# EAGLE design Adafruit 2.4in TFT FeatherWing V2 (EAGLE 9.6.2)
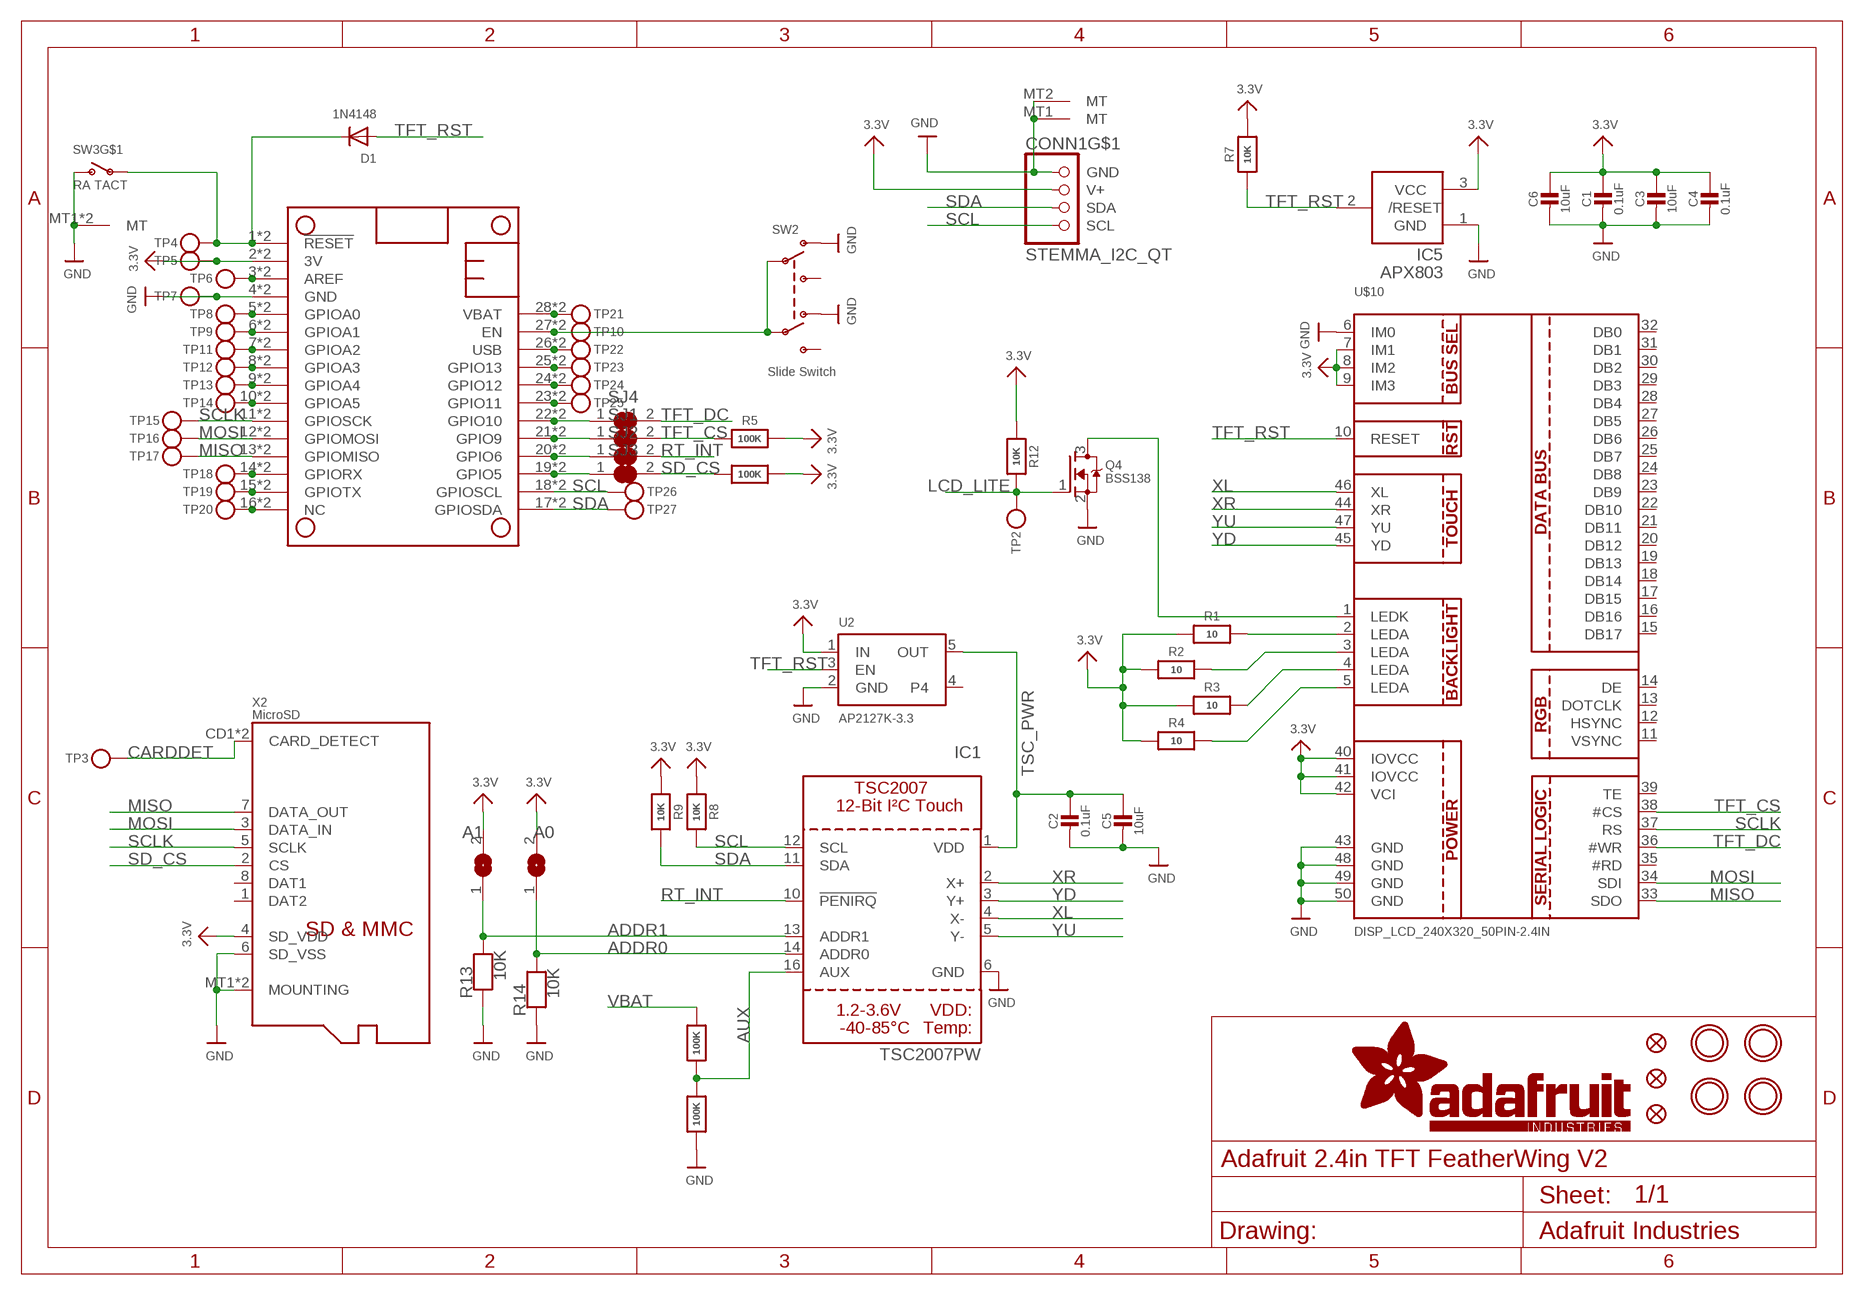
[diagram p0: schematic, sheet 1]

## Parts
C1  0.1uF  CAP_CERAMIC0603_NO  [0603-NO]
C2  0.1uF  CAP_CERAMIC0603_NO  [0603-NO]
C3  10uF  CAP_CERAMIC0805-NOOUTLINE  [0805-NO]
C4  0.1uF  CAP_CERAMIC0603_NO  [0603-NO]
C5  10uF  CAP_CERAMIC0805-NOOUTLINE  [0805-NO]
C6  10uF  CAP_CERAMIC0805-NOOUTLINE  [0805-NO]
CONN1  STEMMA_I2C_QT  [JST_SH4]
D1  1N4148  DIODESOD-323  [SOD-323]
FID1  FIDUCIAL_1MM  [FIDUCIAL_1MM]
FID2  FIDUCIAL_1MM  [FIDUCIAL_1MM]
FID3  FIDUCIAL_1MM  [FIDUCIAL_1MM]
IC1  TSC2007PW  [TSSOP16]
IC5  APX803  AXP083-SAG  [SOT23]
ICSP_CLK1  A1  SOLDERJUMPER  [SOLDERJUMPER_ARROW_NOPASTE]
ICSP_CLK2  A0  SOLDERJUMPER  [SOLDERJUMPER_ARROW_NOPASTE]
MS2  FEATHERWING_SMTDUAL  [FEATHERWING_SMT2]
Q4  BSS138  MOSFET-NWIDE  [SOT23-WIDE]
R1  10  RESISTOR_0603_NOOUT  [0603-NO]
R2  10  RESISTOR_0603_NOOUT  [0603-NO]
R3  10  RESISTOR_0603_NOOUT  [0603-NO]
R4  10  RESISTOR_0603_NOOUT  [0603-NO]
R5  100K  RESISTOR_0603_NOOUT  [0603-NO]
R6  100K  RESISTOR_0603_NOOUT  [0603-NO]
R7  10K  RESISTOR_0603_NOOUT  [0603-NO]
R8  10K  RESISTOR_0603_NOOUT  [0603-NO]
R9  10K  RESISTOR_0603_NOOUT  [0603-NO]
R10  100K  RESISTOR_0603_NOOUT  [0603-NO]
R11  100K  RESISTOR_0603_NOOUT  [0603-NO]
R12  10K  RESISTOR_0603_NOOUT  [0603-NO]
R13  10K  RESISTOR_0603_NOOUT  [0603-NO]
R14  10K  RESISTOR_0603_NOOUT  [0603-NO]
SJ1  SOLDERJUMPER_CLOSED  [SOLDERJUMPER_CLOSEDWIRE]
SJ2  SOLDERJUMPER_CLOSED  [SOLDERJUMPER_CLOSEDWIRE]
SJ3  SOLDERJUMPER_CLOSED  [SOLDERJUMPER_CLOSEDWIRE]
SJ4  SOLDERJUMPER_CLOSED  [SOLDERJUMPER_CLOSEDWIRE]
SW2  Slide Switch  SWITCH_DPDTEG1390  [EG1390]
SW3  RA TACT  SWITCH_SPST_MNT_TACT_RA  [SPST_TACTILE_RA]
TP2  TESTPOINTPAD2MM  [TESTPOINT_PAD_2MM]
TP3  TESTPOINTPAD2MM  [TESTPOINT_PAD_2MM]
TP4  TESTPOINTPAD2MM  [TESTPOINT_PAD_2MM]
TP5  TESTPOINTPAD2MM  [TESTPOINT_PAD_2MM]
TP6  TESTPOINTPAD2MM  [TESTPOINT_PAD_2MM]
TP7  TESTPOINTPAD2MM  [TESTPOINT_PAD_2MM]
TP8  TESTPOINTPAD2MM  [TESTPOINT_PAD_2MM]
TP9  TESTPOINTPAD2MM  [TESTPOINT_PAD_2MM]
TP10  TESTPOINTPAD2MM  [TESTPOINT_PAD_2MM]
TP11  TESTPOINTPAD2MM  [TESTPOINT_PAD_2MM]
TP12  TESTPOINTPAD2MM  [TESTPOINT_PAD_2MM]
TP13  TESTPOINTPAD2MM  [TESTPOINT_PAD_2MM]
TP14  TESTPOINTPAD2MM  [TESTPOINT_PAD_2MM]
TP15  TESTPOINTPAD2MM  [TESTPOINT_PAD_2MM]
TP16  TESTPOINTPAD2MM  [TESTPOINT_PAD_2MM]
TP17  TESTPOINTPAD2MM  [TESTPOINT_PAD_2MM]
TP18  TESTPOINTPAD2MM  [TESTPOINT_PAD_2MM]
TP19  TESTPOINTPAD2MM  [TESTPOINT_PAD_2MM]
TP20  TESTPOINTPAD2MM  [TESTPOINT_PAD_2MM]
TP21  TESTPOINTPAD2MM  [TESTPOINT_PAD_2MM]
TP22  TESTPOINTPAD2MM  [TESTPOINT_PAD_2MM]
TP23  TESTPOINTPAD2MM  [TESTPOINT_PAD_2MM]
TP24  TESTPOINTPAD2MM  [TESTPOINT_PAD_2MM]
TP25  TESTPOINTPAD2MM  [TESTPOINT_PAD_2MM]
TP26  TESTPOINTPAD2MM  [TESTPOINT_PAD_2MM]
TP27  TESTPOINTPAD2MM  [TESTPOINT_PAD_2MM]
U2  AP2127K-3.3  VREG_SOT23-5  [SOT23-5]
U$9  MOUNTINGHOLE2.5  [MOUNTINGHOLE_2.5_PLATED]
U$10  DISP_LCD_240X320_50PIN-2.4IN  [TFT_2.4IN_240X320_50PIN]
U$11  MOUNTINGHOLE2.5  [MOUNTINGHOLE_2.5_PLATED]
U$15  MOUNTINGHOLE2.5  [MOUNTINGHOLE_2.5_PLATED]
U$17  MOUNTINGHOLE2.5  [MOUNTINGHOLE_2.5_PLATED]
X2  MicroSD  MICROSD  [MICROSD]

## Nets
3.3V: C1.1 C3.1 C4.1 C6.1 CONN1.2(V+) IC5.3(VCC) ICSP_CLK1.2 ICSP_CLK2.2 MS2.2'(3V) MS2.2(3V) R1.1 R2.1 R3.1 R4.1 R5.2 R6.2 R7.2 R8.1 R9.1 R12.1 TP5.P$1 U2.1(IN) U$10.7(IM1) U$10.8(IM2) U$10.9(IM3) U$10.40(IOVCC) U$10.41(IOVCC) U$10.42(VCI) X2.4(SD_VDD)
!RESET: D1.C MS2.1'(!RESET) MS2.1(!RESET) SW3.1(P) TP4.P$1
A: MS2.5'(GPIOA0) MS2.5(GPIOA0) TP8.P$1
ADDR0: IC1.14(ADDR0) ICSP_CLK2.1 R14.2
ADDR1: IC1.13(ADDR1) ICSP_CLK1.1 R13.2
AREF: MS2.3'(AREF) MS2.3(AREF) TP6.P$1
AUX: IC1.16(AUX) R10.1 R11.2
B: MS2.6'(GPIOA1) MS2.6(GPIOA1) TP9.P$1
C: MS2.7'(GPIOA2) MS2.7(GPIOA2) TP11.P$1
CARDDET: TP3.P$1 X2.CD1(CARD_DETECT) X2.CD2(CARD_DETECT)
D: MS2.8'(GPIOA3) MS2.8(GPIOA3) TP12.P$1
E: MS2.9'(GPIOA4) MS2.9(GPIOA4) TP13.P$1
EN: MS2.27'(EN) MS2.27(EN) SW2.P1 SW2.P2 TP10.P$1
F: MS2.10'(GPIOA5) MS2.10(GPIOA5) TP14.P$1
G: MS2.16'(NC) MS2.16(NC) TP20.P$1
GND: C1.2 C2.2 C3.2 C4.2 C5.2 C6.2 CONN1.1(GND) CONN1.MT1(MT) CONN1.MT2(MT) IC1.6(GND) IC5.1(GND) MS2.4'(GND) MS2.4(GND) Q4.2(S) R11.1 R13.1 R14.1 SW2.O1 SW2.O2 SW3.2(S) SW3.MT1(MT) SW3.MT2(MT) TP7.P$1 U2.2(GND) U$10.6(IM0) U$10.43(GND) U$10.48(GND) U$10.49(GND) U$10.50(GND) X2.6(SD_VSS) X2.MT1(MOUNTING) X2.MT2(MOUNTING)
H: MS2.19'(GPIO5) MS2.19(GPIO5) SJ3.1
I: MS2.20'(GPIO6) MS2.20(GPIO6) SJ2.1
J: MS2.21'(GPIO9) MS2.21(GPIO9) SJ1.1
K: MS2.22'(GPIO10) MS2.22(GPIO10) SJ4.1
L: MS2.23'(GPIO11) MS2.23(GPIO11) TP25.P$1
LCD_LITE: Q4.1(G) R12.2 TP2.P$1
M: MS2.24'(GPIO12) MS2.24(GPIO12) TP24.P$1
MISO: MS2.13'(GPIOMISO) MS2.13(GPIOMISO) TP17.P$1 U$10.33(SDO) X2.7(DATA_OUT)
MOSI: MS2.12'(GPIOMOSI) MS2.12(GPIOMOSI) TP16.P$1 U$10.34(SDI) X2.3(DATA_IN)
N: MS2.25'(GPIO13) MS2.25(GPIO13) TP23.P$1
N$1: R4.2 U$10.5(LEDA)
N$2: R1.2 U$10.2(LEDA)
N$3: R2.2 U$10.3(LEDA)
N$4: R3.2 U$10.4(LEDA)
N$5: Q4.3(D) U$10.1(LEDK)
RT_INT: IC1.10(!PENIRQ) SJ2.2
RX: MS2.14'(GPIORX) MS2.14(GPIORX) TP18.P$1
SCL: CONN1.4(SCL) IC1.12(SCL) MS2.18'(GPIOSCL) MS2.18(GPIOSCL) R8.2 TP26.P$1
SCLK: MS2.11'(GPIOSCK) MS2.11(GPIOSCK) TP15.P$1 U$10.37(RS) X2.5(SCLK)
SD_CS: R6.1 SJ3.2 X2.2(CS)
SDA: CONN1.3(SDA) IC1.11(SDA) MS2.17'(GPIOSDA) MS2.17(GPIOSDA) R9.2 TP27.P$1
TFT_CS: R5.1 SJ1.2 U$10.38(#CS)
TFT_DC: SJ4.2 U$10.36(#WR)
TFT_RST: D1.A IC5.2(/RESET) R7.1 U2.3(EN) U$10.10(RESET)
TSC_PWR: C2.1 C5.1 IC1.1(VDD) U2.5(OUT)
TX: MS2.15'(GPIOTX) MS2.15(GPIOTX) TP19.P$1
USB: MS2.26'(USB) MS2.26(USB) TP22.P$1
VBAT: MS2.28'(VBAT) MS2.28(VBAT) R10.2 TP21.P$1
XL: IC1.4(X-) U$10.46(XL)
XR: IC1.2(X+) U$10.44(XR)
YD: IC1.3(Y+) U$10.45(YD)
YU: IC1.5(Y-) U$10.47(YU)
Unconnected: SW2.S1 SW2.S2 U2.4 U$10.11(VSYNC) U$10.12(HSYNC) U$10.13(DOTCLK) U$10.14(DE) U$10.15(DB17) U$10.16(DB16) U$10.17(DB15) U$10.18(DB14) U$10.19(DB13) U$10.20(DB12) U$10.21(DB11) U$10.22(DB10) U$10.23(DB9) U$10.24(DB8) U$10.25(DB7) U$10.26(DB6) U$10.27(DB5) U$10.28(DB4) U$10.29(DB3) U$10.30(DB2) U$10.31(DB1) U$10.32(DB0) U$10.35(#RD) U$10.39(TE) X2.1(DAT2) X2.8(DAT1)

## Library data of the parts
C1-C6 = microbuilder:CAP_CERAMIC: Ceramic Capacitors For new designs, use the packages preceded by an '_' character since they are more reliable: The following footprints should be used on most boards: _0402 - Standard footprint for regular board layouts _0603 - Standard footprint for regular board layouts _0805 - Standard footprint for regular board layouts _1206 - Standard footprint for regular board layouts For extremely tight-pitch boards where space is at a premium, the following 'micro-pitch' footprints can be used (smaller pads, no silkscreen outline, etc.): _0402MP - Micro-pitch footprint for very dense/compact boards _0603MP - Micro-pitch footprint for very dense/compact boards _0805MP - Micro-pitch footprint for very dense/compact boards _1206MP - Micro-pitch footprint for very dense/compact boards
CONN1 = adafruit_electromech:STEMMA_I2C; LCSC: C2845363
D1 = microbuilder:DIODE: Diode SMA Model Volts Amps Type Vf Ir Digikey # Notes SSA34-E3 40V 3A Schottky 480mV @ 3A 200uA @ 40V SSA34-E3/61TGITR-ND CDBA120-G 20V 1A Schottky 500mV @ 1A 500uA @ 20V 641-1014-6-ND REEL MBRA210 10V 2A Schottky 350mV @ 2A 700uA @ 10V MBRA210LT3 SOD-123 Model Volts Amps Type Vf Ir Order # Notes BAT54T1G 30V 200mA Schottky 800mV @ 200mA 2uA @ 25V BAT54T1GOSTR-ND B0530W 30V 500mA Schottky 430mV @ 500mA 130uA @ 30V B0530W-FDICT-ND REEL MBR120 20V 1A Schottky 340mV @ 1A MBR120VLSFT1GOSCT-ND SOD-323 Model Volts Amps Type Vf Ir Order # Notes PMEG2005EJ 20V 500mA Schottky 355mV @ 500mA 568-4110-1-ND ZLLS410 10V 570mA Schottky 380mV @ 570mA ZLLS410CT-ND 1N4148WS 75V 150mA Silicon/Simple 1V 1N4148WSFSCT-ND REEL SOD-523 Model Volts Amps Type Vf Ir Order # Notes BAT54XV2 30V 200mA Schottky 0.8V @ 100mA BAT54XV2CT-ND TB751S 30V 30mA Schottky RB751S-40TE61CT-ND SOT23-R/W (R = Solder Paste/Reflow Ovens, W = Hand-Soldering) Model Volts Amps Type Vf Ir Order # Notes BAT54FILM 40V 300mA Schottky 497-7162-1-ND POWERDI-5 Model Volts Amps Type Vf Ir Order # Notes PDS560 60V 5A Schottky 670mV @ 5A 150uA @ 60V PDS560DICT-ND
FID1-FID3 = microbuilder:FIDUCIAL: Fiducial Alignment Points Various fiducial points for machine vision alignment.; BOM: EXCLUDE
IC1 = adafruit_sensor:TSC2007
IC5 = adafruit:AXP083
ICSP_CLK1 ICSP_CLK2 = microbuilder:SOLDERJUMPER: SMD Solder JUMPER Solder the two pads together to create a connection, or remove the solder to break it. REFLOW - Use this footprint for solder paste and reflow ovens. WAVE - Use this footprint for hand-soldering (larger pads). CLOSED - Has a trace between the two pads to ensure it is closed by default. The trace needs to be cut to disable the jumper, and can be closed again by creating a solder bridge between the two pads.; BOM: EXCLUDE
MS2 = microbuilder:FEATHERWING
Q4 = microbuilder:MOSFET-N: N-Channel Mosfet LEGEND VDS: Voltage Drain-Source ID: Drain Current RDS(ON): Drain-Source On-State Resistance VGS(TH): Gate-Source Threshold Voltage CISS: Drain-Source Input Capacitance SOT-23 Name VDS ID RDS(ON) VGS(TH) CISS Order Number 2N7002E 60V 260mA 2.5 Ohm 2.5V @ 250uA 26.7pF @ 25V 2N7002ET1GOSTR-ND BSH103 30V 850mA 400 mOhm 400mV @ 1mA 83pF @ 24V BSH103,235-ND BSS138 60V 320mA 1.6 Ohm 1.5V @ 250uA 50pF @ 10V Mouser: 771-BSS138PW115 DMN2075U-7 20V 4.2A 38 mOhm 1V @ 250 uA 594.3pF @ 10V DMN2075U-7DICT-ND * BSS138 good choice for I2C level-shifting POWERPAK 1212-8 Name VDS ID RDS(ON) VGS(TH) CISS Order Number Si7308DN 60V 6A 58 mOhm 3V @ 250uA 665pF @ 15V SI7308DN-T1-E3CT-ND
R1-R14 = microbuilder:RESISTOR: Resistors For new designs, use the packages preceded by an '_' character since they are more reliable: The following footprints should be used on most boards: _0402 - Standard footprint for regular board layouts _0603 - Standard footprint for regular board layouts _0805 - Standard footprint for regular board layouts _1206 - Standard footprint for regular board layouts For extremely tight-pitch boards where space is at a premium, the following 'micro-pitch' footprints can be used (smaller pads, no silkscreen outline, etc.): _0402MP - Micro-pitch footprint for very dense/compact boards _0603MP - Micro-pitch footprint for very dense/compact boards _0805MP - Micro-pitch footprint for very dense/compact boards _1206MP - Micro-pitch footprint for very dense/compact boards
SJ1-SJ4 = microbuilder:SOLDERJUMPER_CLOSED: Solder Jumper - Closed These solder jumpers are closed by default CLOSEDWIRE - 10 mil trace between pads that can be cut and resoldered later CLOSEDPERM - 63 mil trace between pads for a permanent connection (used to 'bridge' two signals, a shameless hack for Eagle). Can double as a test point as well (no cream layer)
SW2 = adafruit_electromech:SWITCH_DPDT: Switch - DPDT A DPDT Switch acts like an SPDT switch, but has a pair of switches instead of just one. Vertical - 0.3A @ 6V SMT - Digikey: JS202011SCQN; LCSC: C2837066
SW3 = adafruit_electromech:SWITCH_SPST_MNT: Switch - SPST 4UCon 19192 (6.7x2.6mm SMT); LCSC: C778159
TP2-TP27 = microbuilder:TESTPOINT: Test Point Various test points for characterisation and PCB testing TESTPOINT_SMT - Compact Surface Mount Test Point [Digikey: 5016KTR-ND]
U2 = adafruit_power:VREG_SOT23-5: SOT23-5 Fixed Voltage Regulators Part Current Out V Out V In V Dropout θJA (°C/W) TJ (°C) Digikey Part No. ADP121 150mA 3.3V 3.4-5.5V 0.09V @ 150mA -- -- ADP121-AUJZ33R7CT-ND ADP121 150mA 3.0V 3.1-5.5V 0.09V @ 150mA -- -- ADP121-AUJZ30R7CT-ND ADP122 300mA 3.3V 3.4-5.5V 0.085V @ 300mA -- -- ADP122AUJZ-3.3-R7CT-ND ADP1712 300mA 3.3V 3.5-5.5V 0.17V @ 300mA -- -- ADP1712AUJZ-3.3-R7TR-ND AP7311 (Low Cost) 150mA 3.3V 3.5-6V 0.15V @ 150mA -- -- AP7311-33WG-7DICT-ND LD39015M18R 150mA 1.8V 1.9V-5.5V 0.08V @ 100mA -- -- 497-6977-1-ND LP2985A-33DBVR 150mA 3.3V 3.3-16V 0.28V @ 150mA 206 150 296-18479-1-ND MCP1824T-3302E/OT 300mA 3.3V 3.5V-6V 0.2V @ 300mA -- -- MCP1824T-3302E/OTCT-ND MIC5205-2.5YM5 TR 150mA 2.5V 2.7-16V 0.165V @ 150mA -- -- 576-1257-2-ND MIC5205-3.0YM5 TR 150mA 3.0V 3.2V-16V 0.165V @ 150mA -- -- 576-1258-2-ND MIC5205-3.3YM5 TR 150mA 3.3V 3.5V-16V 0.165V @ 150mA -- -- 576-1259-2-ND TPS780330220 150mA 3.3V+2.2V 3.6-5.5V 250mV Max -- -- 296-23332-1-ND TDA3663/N1,135 100mA 3.3V 3.5-45V 0.18V @ 50mA -- -- 568-5343-1-ND Max operating temp can be calculated using θJA, TJ (max junction temperature), and power in watts. Set the "Maximum Ambient Temperature" until it reaches TJ ("Max Junction Temperature"), which is the absolute limit for safe use of the regulator: Heat Sink Temperature Calculator <http://www.daycounter.com/Calculators/Heat-Sink-Temperature-Calculator.phtml> For example, With 12V source into a 3.3V LP2985 and a 30mA load, we are dissipating (12V-3.3V) * 0.03A = 0.261W. With a θJA of 206 °C/W, a TJ of 150°C, and 261mW we can safely use the chip without a heat sink up to 75°C (=147.1°C Junction Temperature).; JLC_ROTATION: 270
U$9 U$11 U$15 U$17 = adafruit_electromech:MOUNTINGHOLE: Mounting Hole For #2 screws (0.086"/2.18mm width, 0.094"/2.4mm hole) use 2.5mm; BOM: EXCLUDE
U$10 = adafruit_display:DISP_LCD_240X320_50PIN
X2 = adafruit_electromech:MICROSD: MicroSD/Transflash Card Holder with SPI pinout 3M: 2908-05WB-MG 4UConnector: 19656 Footprint courtesy: Adafruit Industries; JLC_ROTATION: 90; LCSC: C125617

## Board
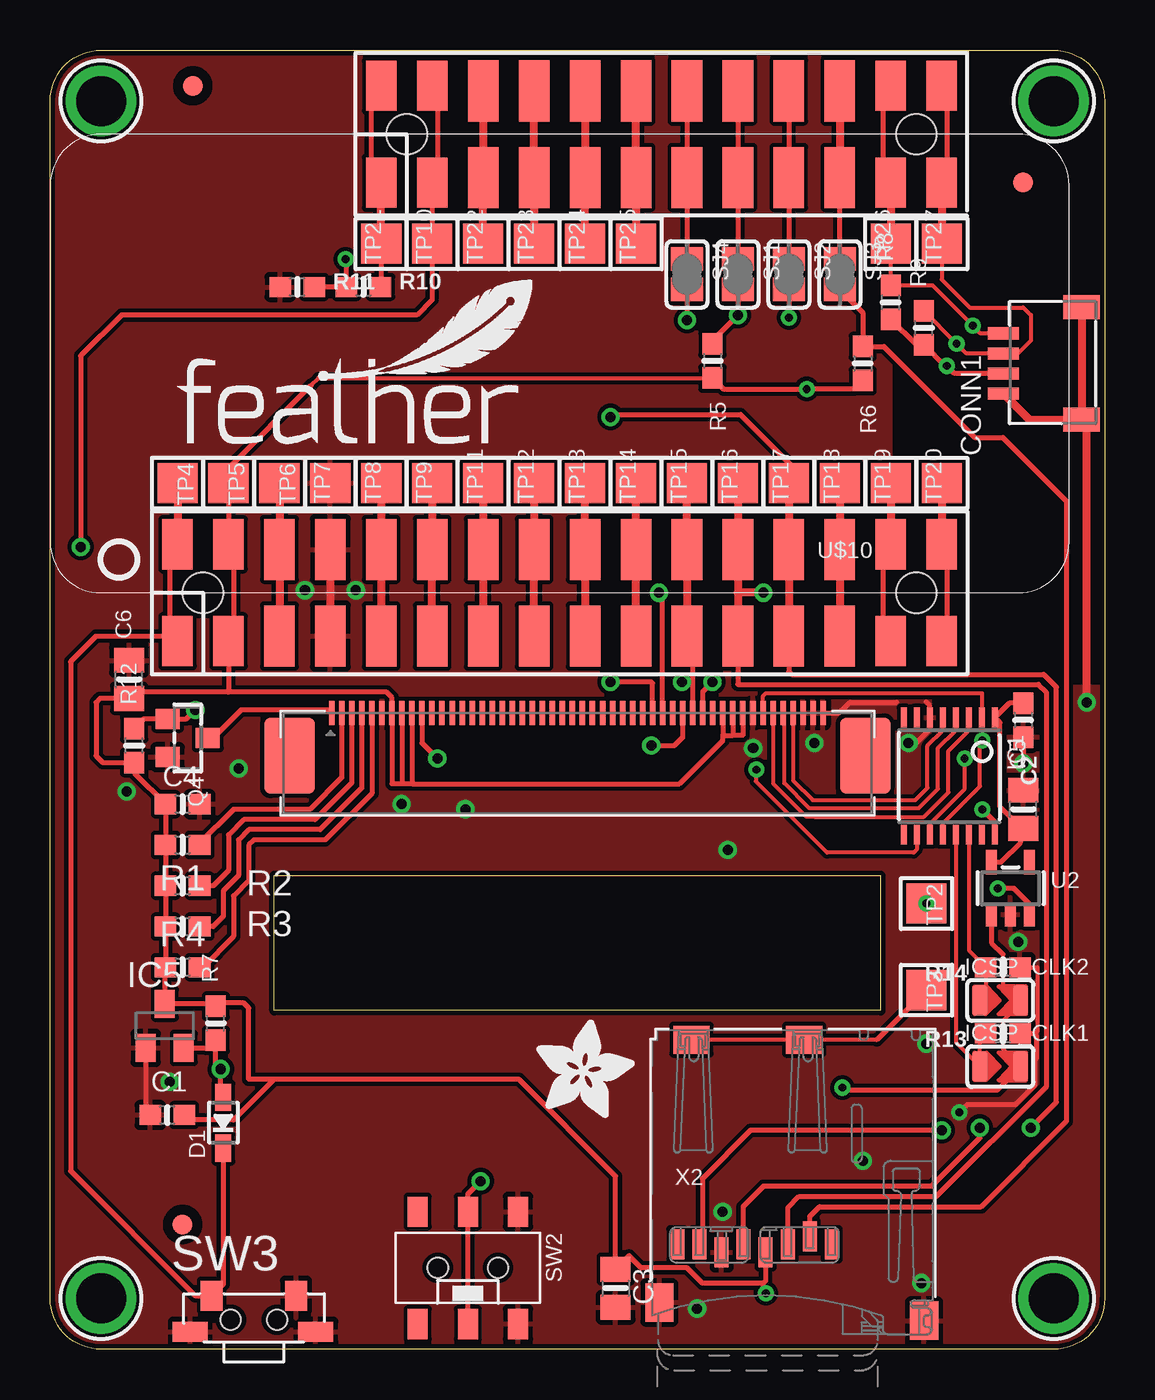
[diagram p1: board, top side]
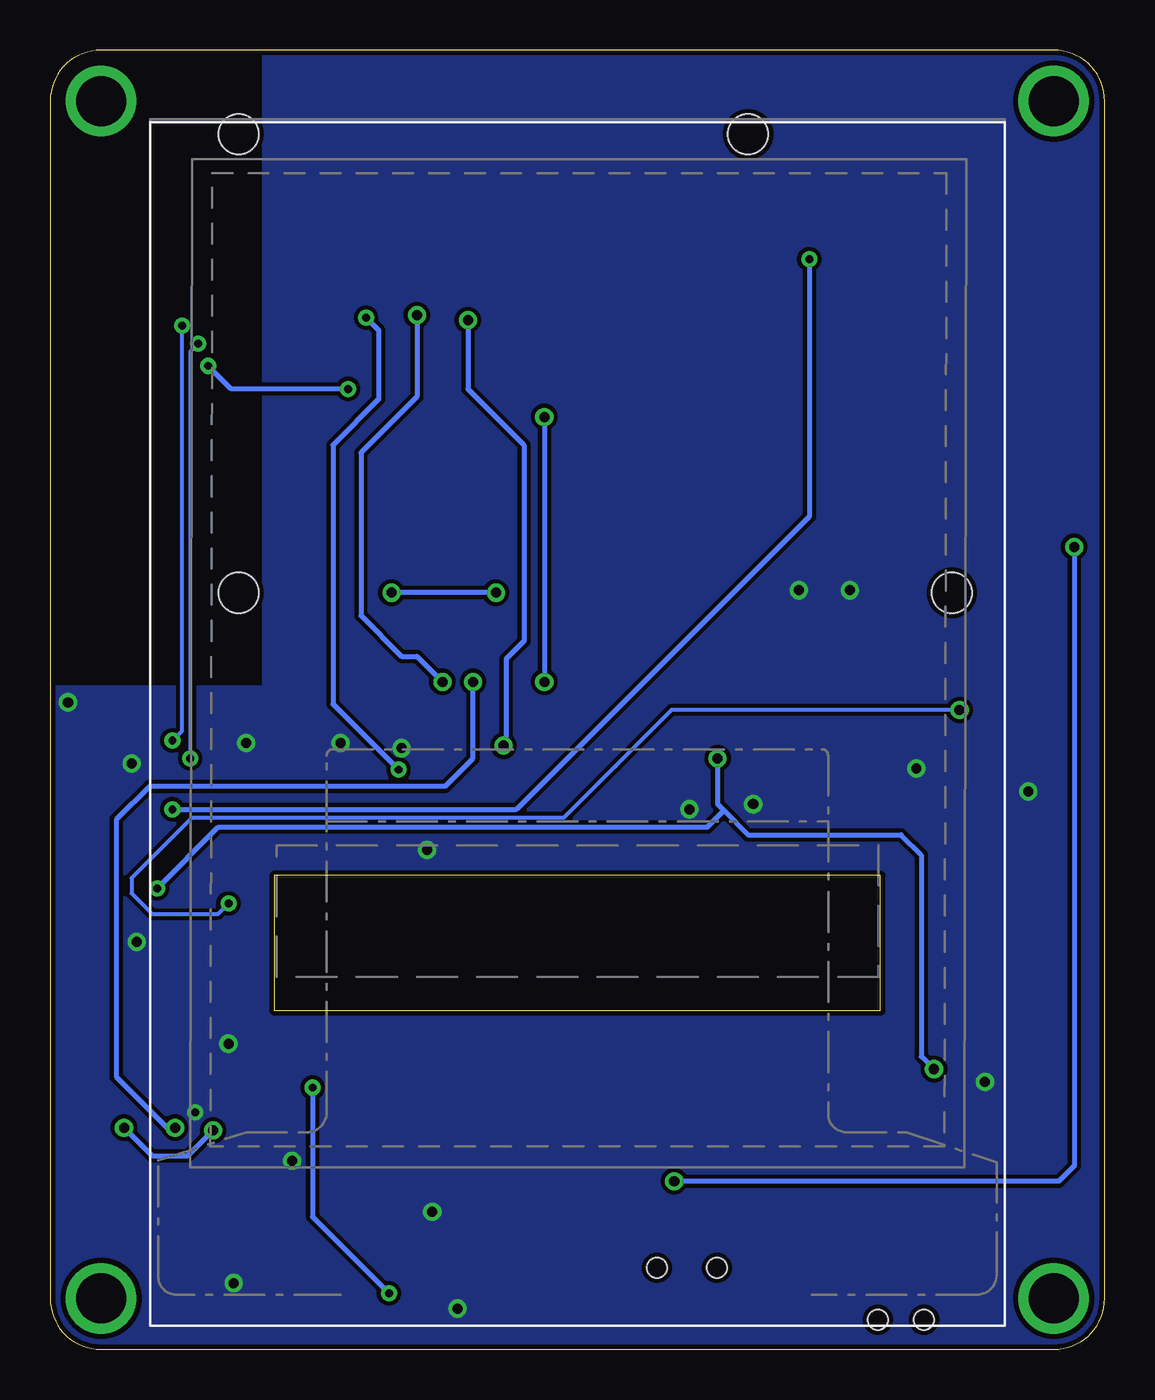
[diagram p2: board, bottom side, seen from below]

Size 52.58 x 64.77 mm. Coordinates in mm from the lower left corner, seen from the top.
Outline: 2.54,64.77 50.04,64.77 arc-90 52.58,62.23 52.58,2.54 arc-90 50.04,0 2.54,0 arc-90 0,2.54 0,62.23 arc-90 2.54,64.77
Outline: 11.18,23.62 41.4,23.62 41.4,16.89 11.18,16.89 11.18,23.62
Copper layers (1*16): Top 0.035mm / dielectric 1.5mm / Bottom 0.035mm
Design rules "adafruit *": minimum track width 8mil, minimum drill 15.5mil, track to track 8mil, track to pad 8mil, pad to pad 8mil, via to via 8mil, smd to smd 8mil, copper to edge 10mil, drill to drill 8mil, minimum pad ring 10mil, minimum via ring 8mil, stop-mask expansion 2mil, vias tented up to drill 20mil, thermal gap 10mil

### Footprints (pad centres in the part's own frame; a part is rotated, then mirrored left to right if it is on the bottom)
0603-NO = smd 1.075 x 1: 1 -0.85,0; 2 0.85,0
0805-NO = smd 1.24 x 1.5: 1 -0.95,0; 2 0.95,0
JST_SH4 = smd 0.6 x 1.55: 1 -1.5,2.006; 2 -0.5,2.006; 3 0.5,2.006; 4 1.5,2.006 | smd 1.2 x 1.8: MT1 -2.8,-1.894; MT2 2.8,-1.894
SOD-323 = smd 1.35 x 0.8: A 1.27,0; C -1.27,0
FIDUCIAL_1MM = smd 1 x 1: 1 0,0
TSSOP16 = smd 0.305 x 0.991: 1 -2.275,-2.918; 2 -1.625,-2.918; 3 -0.975,-2.918; 4 -0.325,-2.918; 5 0.325,-2.918; 6 0.975,-2.918; 7 1.625,-2.918; 8 2.275,-2.918; 9 2.275,2.918; 10 1.625,2.918; 11 0.975,2.918; 12 0.325,2.918; 13 -0.325,2.918; 14 -0.975,2.918; 15 -1.625,2.918; 16 -2.275,2.918
SOT23 = smd 1 x 1.4: 1 -0.95,-1.1; 2 0.95,-1.1; 3 0,1.1
SOLDERJUMPER_ARROW_NOPASTE = smd 0.762 x 1.524: 1 -1.016,0; 2 1.016,0
FEATHERWING_SMT2 = smd 1.524 x 2.5: 1 6.35,2.413; 1' 6.35,-2.413; 2 8.89,2.413; 2' 8.89,-2.413; 15 41.91,2.413; 15' 41.91,-2.413; 16 44.45,2.413; 16' 44.45,-2.413; 17 44.45,20.447; 17' 44.45,25.273; 18 41.91,20.447; 18' 41.91,25.273; 27 19.05,20.447; 27' 19.05,25.273; 28 16.51,20.447; 28' 16.51,25.273 | smd 1.524 x 3.048: 3 11.43,2.159; 3' 11.43,-2.159; 4 13.97,2.159; 4' 13.97,-2.159; 5 16.51,2.159; 5' 16.51,-2.159; 6 19.05,2.159; 6' 19.05,-2.159; 7 21.59,2.159; 7' 21.59,-2.159; 8 24.13,2.159; 8' 24.13,-2.159; 9 26.67,2.159; 9' 26.67,-2.159; 10 29.21,2.159; 10' 29.21,-2.159; 11 31.75,2.159; 11' 31.75,-2.159; 12 34.29,2.159; 12' 34.29,-2.159; 13 36.83,2.159; 13' 36.83,-2.159; 14 39.37,2.159; 14' 39.37,-2.159; 19 39.37,20.701; 19' 39.37,25.019; 20 36.83,20.701; 20' 36.83,25.019; 21 34.29,20.701; 21' 34.29,25.019; 22 31.75,20.701; 22' 31.75,25.019; 23 29.21,20.701; 23' 29.21,25.019; 24 26.67,20.701; 24' 26.67,25.019; 25 24.13,20.701; 25' 24.13,25.019; 26 21.59,20.701; 26' 21.59,25.019 | hole 2: 17.78,22.86; 43.18,22.86; 7.62,0; 43.18,0
SOT23-WIDE = smd 1 x 1.2: 1 -0.95,-1; 2 0.95,-1; 3 0,1
SOLDERJUMPER_CLOSEDWIRE = smd 1.168 x 1.6: 1 -0.762,0; 2 0.762,0 | smd 0.635 x 0.203: WIRE 0,0
EG1390 = smd 1 x 1.5: O1 -2.5,2.8; O2 -2.5,-2.8; P1 0,2.8; P2 0,-2.8; S1 2.5,2.8; S2 2.5,-2.8 | hole 1: 1.5,0; -1.5,0
SPST_TACTILE_RA = smd 1.1 x 1.5: 1 2.1,-0.9; 2 -2.1,-0.9 | smd 1.75 x 1: MT1 3.175,0.9; MT2 -3.075,0.9 | hole 1: 1.15,0.3; -1.15,0.3
TESTPOINT_PAD_2MM = smd 2 x 2: P$1 0,0
SOT23-5 = smd 0.55 x 1.2: 1 -0.95,-1.3; 2 0,-1.3; 3 0.95,-1.3; 4 0.95,1.3; 5 -0.95,1.3
MOUNTINGHOLE_2.5_PLATED = drill 2.5 pad 3.2: P$1 0,0
TFT_2.4IN_240X320_50PIN = smd 0.275 x 1.2 bottom: 1 -12.25,-0.992; 2 -11.75,-0.992; 3 -11.25,-0.992; 4 -10.75,-0.992; 5 -10.25,-0.992; 6 -9.75,-0.992; 7 -9.25,-0.992; 8 -8.75,-0.992; 9 -8.25,-0.992; 10 -7.75,-0.992; 11 -7.25,-0.992; 12 -6.75,-0.992; 13 -6.25,-0.992; 14 -5.75,-0.992; 15 -5.25,-0.992; 16 -4.75,-0.992; 17 -4.25,-0.992; 18 -3.75,-0.992; 19 -3.25,-0.992; 20 -2.75,-0.992; 21 -2.25,-0.992; 22 -1.75,-0.992; 23 -1.25,-0.992; 24 -0.75,-0.992; 25 -0.25,-0.992; 26 0.25,-0.992; 27 0.75,-0.992; 28 1.25,-0.992; 29 1.75,-0.992; 30 2.25,-0.992; 31 2.75,-0.992; 32 3.25,-0.992; 33 3.75,-0.992; 34 4.25,-0.992; 35 4.75,-0.992; 36 5.25,-0.992; 37 5.75,-0.992; 38 6.25,-0.992; 39 6.75,-0.992; 40 7.25,-0.992; 41 7.75,-0.992; 42 8.25,-0.992; 43 8.75,-0.992; 44 9.25,-0.992; 45 9.75,-0.992; 46 10.25,-0.992; 47 10.75,-0.992; 48 11.25,-0.992; 49 11.75,-0.992; 50 12.25,-0.992 | smd 2.54 x 3.81 bottom: PAD1 -14.35,1.143; PAD2 14.35,1.143
MICROSD = smd 0.7 x 1.5: 1 1.761,-3.147; 2 0.661,-2.747; 3 -0.439,-3.147; 4 -1.539,-3.547; 5 -2.639,-3.147; 6 -3.739,-3.547; 7 -4.839,-3.147; 8 -5.939,-3.147 | smd 1.8 x 1.4: CD1 -5.239,7.053; CD2 0.38,7.053 | smd 1.4 x 1.9: MT1 -6.839,-6.047; MT2 6.361,-6.947

### Placement (x,y rotation side)
C1  5.84,11.68 180 top
C2  48.51,31.37 270 top
C3  28.19,3.05 270 top
C4  6.6,27.18 0 top
C5  48.51,26.92 90 top
C6  3.94,33.4 90 top
CONN1  49.53,49.15 90 top
D1  8.64,11.3 90 top
FID1  48.51,58.17 270 top
FID2  6.6,6.22 270 top
FID3  7.11,62.99 270 top
IC1  44.83,28.57 180 top
IC5  5.71,16.13 0 top
ICSP_CLK1  47.37,14.1 0 top
ICSP_CLK2  47.37,17.4 0 top
MS2  0,37.72 0 top
PLABEL0  [PLABEL0]  39.75,49.15 90 top
PLABEL1  [PLABEL1]  34.8,46.99 90 top
PLABEL2  [PLABEL2]  37.34,48.51 90 top
PLABEL3  [PLABEL3]  42.55,23.75 0 top
PLABEL4  [PLABEL4]  42.93,19.56 0 top
PLABEL5  [PLABEL5]  32.26,46.86 90 top
PLABEL6  [PLABEL6]  7.75,3.81 0 top
PLABEL7  [PLABEL7]  26.16,2.29 90 top
PLABEL8  [PLABEL8]  16.76,2.54 90 top
PLABEL9  [PLABEL9]  10.92,6.35 0 top
PLABEL10  [PLABEL10]  52.07,10.67 90 top
PLABEL11  [PLABEL11]  46.23,0.64 90 top
PLABEL12  [PLABEL12]  50.29,13.21 90 top
PLABEL13  [PLABEL13]  50.29,16.51 90 top
Q4  6.86,30.48 270 top
R1  6.6,25.15 0 top
R2  6.6,23.11 0 top
R3  6.6,21.08 0 top
R4  6.6,19.05 0 top
R5  33.02,49.28 270 top
R6  40.51,49.15 270 top
R7  8.26,16.26 90 top
R8  41.91,52.2 90 top
R9  43.56,50.93 90 top
R10  15.62,52.96 0 top
R11  12.32,52.96 0 top
R12  4.19,30.1 90 top
R13  47.5,15.75 180 top
R14  47.5,19.05 180 top
SJ1  34.29,53.59 270 top
SJ2  36.83,53.59 270 top
SJ3  39.37,53.59 270 top
SJ4  31.75,53.59 270 top
SW2  20.83,4.06 180 top
SW3  10.16,1.78 180 top
TP2  43.69,22.23 270 top
TP3  43.69,17.91 270 top
TP4  6.35,43.18 270 top
TP5  8.89,43.18 270 top
TP6  11.43,43.18 270 top
TP7  13.97,43.18 90 top
TP8  16.51,43.18 90 top
TP9  19.05,43.18 90 top
TP10  19.05,55.12 90 top
TP11  21.59,43.18 90 top
TP12  24.13,43.18 90 top
TP13  26.67,43.18 90 top
TP14  29.21,43.18 90 top
TP15  31.75,43.18 90 top
TP16  34.29,43.18 90 top
TP17  36.83,43.18 90 top
TP18  39.37,43.18 90 top
TP19  41.91,43.18 90 top
TP20  44.45,43.18 90 top
TP21  16.51,55.12 90 top
TP22  21.59,55.12 90 top
TP23  24.13,55.12 90 top
TP24  26.67,55.12 90 top
TP25  29.21,55.12 90 top
TP26  41.91,55.12 90 top
TP27  44.45,55.12 90 top
U2  47.88,22.99 0 top
U$9  2.54,62.23 270 top
U$10  26.29,30.73 180 bottom
U$11  50.04,62.23 270 top
U$15  2.54,2.54 270 top
U$17  50.04,2.54 270 top
U$29  [FEATHERLOGO_MED]  6.22,45.09 0 top
U$30  [ADAFRUIT_5MM]  24.26,11.56 0 top
U$34  [PCBFEAT-REV-040]  3.43,39.37 270 top
X2  37.21,8.38 0 top

### Tracks (layer width: path | path; a pad name or v marks a point on that pad's centre or on a via)
3.3V  (via drill 0.39)
  Top 0.203: ICSP_CLK2.2 48.32,17.34 | ICSP_CLK1.2 47.5,14.99 47.5,16.38 48.39,17.27 48.32,17.34 | 13.02,48.07 13.37,48.43 R5.2 | 47.5,19.7 47.5,18.16 48.32,17.34
  Top 0.254: C1.1 6.95,11.43 9.14,11.43 11.18,13.46 | 8.89,32.77 MS2.2' 8.89,35.94 9.14,36.2 9.14,39.88 MS2.2 TP5.P$1 | U$10.42 34.54,30.61 34.04,30.61 | U$10.9 18.04,28.19 | 18.04,28.19 17.54,28.19 | 17.54,28.19 17.04,28.19 U$10.7 17.04,32.49 16.76,32.77 8.89,32.77 | U$10.8 17.54,28.19 | 18.04,28.19 31.37,28.19 33.54,30.36 33.54,30.61 | 33.54,30.61 34.04,30.61 | 8.89,43.69 8.89,43.94 13.02,48.07 | 11.18,13.46 23.37,13.46 28.19,8.64 C3.1 28.86,4.67 29.46,4.06 31.75,4.06 32.51,3.3 35.56,3.3 | 11.18,13.46 9.91,13.46 9.91,17.02 9.65,17.27 8.55,17.27 8.38,17.11 R7.2 8.13,17.23 IC5.3 5.71,19.01 R4.1 R3.1 R2.1 R1.1 C4.1 4.19,28.74 R12.1 2.63,29.25 2.29,29.59 2.29,32.26 2.48,32.45 C6.1 4.25,32.77 8.89,32.77 | X2.4 35.67,3.41 35.56,3.3 | CONN1.2 45.09,48.65 v44.7,49.03 44.61,49.03 R9.1 43.18,50.08 R8.1 | R5.2 33.57,47.88 v37.72,47.88 40.09,47.88 R6.2 | v39.5,13.05 39.62,12.92 47.21,12.92 ICSP_CLK1.2 | v35.69,2.79 35.56,2.92 35.56,3.3 | U2.1 46.93,20.27 47.5,19.7 | U$10.41 34.04,30.61 | U$10.40 33.54,30.61
  Top 0.406: TP5.P$1 8.89,43.69
  Bottom 0.254: v37.72,47.88 43.55,47.88 v44.7,49.03 | v39.5,13.05 39.5,6.6 v35.69,2.79
!RESET
  Top 0.254: MS2.1 5.97,39.75 5.97,36.32 6.35,35.94 MS2.1' 6.1,35.56 2.29,35.56 1.02,34.29 1.02,8.89 7.23,2.68 SW3.1 8.64,3.25 D1.C
  Top 0.406: TP4.P$1 MS2.1
A
  Top 0.406: MS2.5' MS2.5 TP8.P$1
ADDR0
  Top 0.203: IC1.14 45.81,19.89 R14.2 46.65,17.69 ICSP_CLK2.1
ADDR1
  Top 0.203: IC1.13 45.16,15.3 ICSP_CLK1.1 46.35,15.46 R13.2
AREF
  Top 0.406: MS2.3' MS2.3 TP6.P$1
AUX  (via drill 0.39)
  Top 0.254: R11.2 R10.1 14.77,54.32 v14.73,54.36 | IC1.16 47.11,26.3 v46.48,26.92
  Bottom 0.254: v14.73,54.36 14.73,41.53 29.34,26.92 v46.48,26.92
B
  Top 0.406: MS2.6' 19.05,38.99 18.92,38.99 18.92,39.88 MS2.6 TP9.P$1
C
  Top 0.406: MS2.7' 21.34,35.56 21.34,36.07 21.59,36.07 MS2.7 TP11.P$1
CARDDET
  Top 0.203: 41.22,15.44 X2.CD2 X2.CD1
  Top 0.254: TP3.P$1 41.22,15.44
D
  Top 0.406: MS2.8' MS2.8 TP12.P$1
E
  Top 0.406: MS2.9' 26.16,35.56 26.16,36.32 26.67,36.32 MS2.9 TP13.P$1
EN  (via drill 0.5)
  Top 0.254: SW2.P2 SW2.P1 20.83,7.75 v21.46,8.38 | TP10.P$1 MS2.27 19.05,58.67 19.3,58.93 19.3,62.74 MS2.27' | 19.05,54.86 19.05,52.32 18.29,51.56 3.56,51.56 1.52,49.53 v1.52,40.01
  Top 0.406: TP10.P$1 19.05,54.86
  Bottom 0.254: v1.52,40.01 1.52,9.14 2.29,8.38 v21.46,8.38
F
  Top 0.406: MS2.10' MS2.10 TP14.P$1
G
  Top 0.254: MS2.16 44.7,39.88 44.7,35.94 44.45,35.69 MS2.16'
  Top 0.406: TP20.P$1 MS2.16
GND  (via drill 0.39, 0.5)
  Top 0.203: R14.1 49.23,19.05 49.23,15.88 49.1,15.75 R13.1
  Top 0.254: C1.2 4.76,11.91 IC5.1 | R13.1 49.07,15.75 49.16,15.66 49.16,14.49 49.1,14.43 49.1,13.17 48.12,12.19 45.72,12.19 v45.34,11.81 | C2.2 v48.51,29.21 | 43.66,32.28 43.86,32.09 IC1.6 43.86,30.9 43.18,30.23 v42.8,30.23 | U$10.50 39.32,31.73 39.42,31.83 39.45,31.83 39.88,32.26 42.21,32.26
  Top 0.406: MS2.4 MS2.4' | CONN1.MT2 CONN1.MT1 | CONN1.1 48.82,46.35 CONN1.MT1 | CONN1.MT1 51.69,46.08 v51.69,32.26
  other vias: 9.4,28.96 17.53,27.18 38.1,30.23 15.24,37.85 12.7,37.85 33.53,6.86 32.26,2.03 43.43,3.3 20.7,26.92 40.51,9.4 43.69,15.24 35.05,29.97 48.26,20.32 3.81,27.81 5.97,13.34 33.78,24.89
  pour Top: 41.91,64.64 0,64.77 0,0 52.58,0 52.58,33.02 41.91,33.02
  pour Bottom: 41.91,64.77 0,64.77 0,0 52.58,0 52.58,33.02 41.91,33.02
H
  Top 0.254: SJ3.1 MS2.19
  Top 0.406: MS2.19' MS2.19
I
  Top 0.254: MS2.20' MS2.20 SJ2.1
J
  Top 0.254: MS2.21' MS2.21 SJ1.1
K
  Top 0.254: MS2.22' MS2.22 SJ4.1
L
  Top 0.406: MS2.23' MS2.23 TP25.P$1
LCD_LITE  (via drill 0.39, 0.5)
  Top 0.254: v7.24,31.88 6.79,31.43 Q4.1 4.67,31.43 R12.2
  Bottom 0.203: v7.24,31.88 21.59,31.88 24.38,29.08 26.98,26.49 45.52,26.49 48.51,23.5 48.51,22.73 47.5,21.72 44.2,21.72 TP2.P$1
  other vias: 43.69,22.23
M
  Top 0.406: MS2.24' MS2.24 TP24.P$1
MISO  (via drill 0.5)
  Top 0.254: X2.7 32.51,5.38 32.51,8.51 34.92,10.92 v44.45,10.92 | U$10.33 30.04,33.21 29.97,33.27 v27.94,33.27 | MS2.13' 36.83,33.78 36.96,33.66 49.53,33.66 50.16,33.02 50.16,12.32 v48.9,11.05 | v27.94,46.48 28.07,46.61 34.42,46.61 37.08,43.94 37.08,42.93 36.83,42.67
  Top 0.406: MS2.13' MS2.13 36.83,42.67 TP17.P$1
  Bottom 0.254: v44.45,10.92 45.72,9.65 47.5,9.65 v48.9,11.05 | v27.94,46.48 v27.94,33.27
MOSI  (via drill 0.5)
  Top 0.254: X2.3 36.77,7.05 37.34,7.62 44.2,7.62 49.66,13.08 49.66,32.77 49.28,33.15 34.29,33.15 MS2.12' | U$10.34 30.54,37.53 v30.35,37.72
  Top 0.406: 34.29,37.72 MS2.12 TP16.P$1 | v35.56,37.72 34.29,37.72 | 34.29,37.72 MS2.12'
  Bottom 0.254: v30.35,37.72 v35.56,37.72
N
  Top 0.406: MS2.25' MS2.25 TP23.P$1
N$1
  Top 0.254: U$10.5 16.04,27.72 13.72,25.4 10.16,25.4 9.91,25.15 9.91,23.37 9.14,22.61 9.14,20.57 7.62,19.05 R4.2
N$2
  Top 0.254: U$10.2 14.54,28.51 12.95,26.92 9.14,26.92 7.45,25.23 R1.2
N$3
  Top 0.254: U$10.3 15.04,28.25 13.21,26.42 9.65,26.42 8.89,25.65 8.89,23.88 8.13,23.11 R2.2
N$4
  Top 0.254: U$10.4 15.54,27.98 13.46,25.91 9.91,25.91 9.4,25.4 9.4,23.62 8.64,22.86 8.64,21.59 8.13,21.08 R3.2
N$5
  Top 0.254: U$10.1 13.89,31.88 9.53,31.88 8.13,30.48 Q4.3
RT_INT  (via drill 0.39)
  Top 0.203: IC1.10 43.21,24.92 43.05,24.77 38.73,24.77 35.18,28.32 35.18,28.87 v35.21,28.9
  Top 0.254: SJ2.2 v36.83,51.44
  Bottom 0.254: v36.83,51.44 36.2,50.8 36.2,47.37 38.48,45.09 38.48,32.17 v35.21,28.9
RX
  Top 0.406: MS2.14' MS2.14 TP18.P$1
SCL  (via drill 0.39)
  Top 0.203: CONN1.4 46.38,50.65 v46,51.03 43.98,53.05 R8.2 TP26.P$1 | IC1.12 44.51,26.22 46.35,28.07 46.35,30.35 v46.48,30.35
  Top 0.254: MS2.18' 41.53,62.61 41.53,58.93 41.91,58.55 MS2.18
  Top 0.406: MS2.18 TP26.P$1
  Bottom 0.203: v46.48,30.35 46,30.84 v46,51.03
SCLK  (via drill 0.5)
  Top 0.254: U$10.37 32.04,33.28 | 32.04,33.28 32.04,35.27 MS2.11' | X2.5 34.54,5.26 34.54,7.11 35.56,8.13 43.94,8.13 46.35,10.54 v46.35,11.05 | 32.04,33.28 v31.5,33.28 v31.5,33.27
  Top 0.406: MS2.11' MS2.11 TP15.P$1
  Bottom 0.254: v46.35,11.05 46.74,11.05 49.28,13.59 49.28,26.42 47.62,28.07 32.89,28.07 31.5,29.46 v31.5,33.27
SD_CS
  Top 0.254: X2.2 37.87,6.63 38.35,7.11 46.42,7.11 50.67,11.37 50.67,42.29 47.5,45.47 46.1,45.47 41.57,50 R6.1 40.51,51.69 SJ3.2
SDA  (via drill 0.39)
  Top 0.203: TP27.P$1 44.45,53.34 45.85,51.94 48.51,51.94 48.9,51.56 48.9,50.29 48.25,49.65 CONN1.3 45.69,49.65 v45.19,50.15 R9.2 | IC1.11 43.86,26.2 45.59,27.94 v45.59,29.45
  Top 0.254: MS2.17' 44.7,62.74 44.7,59.05 44.45,58.8 MS2.17
  Top 0.406: MS2.17 TP27.P$1
  Bottom 0.203: v45.59,29.45 45.57,29.45 45.57,49.76 v45.19,50.15
TFT_CS  (via drill 0.5)
  Top 0.254: SJ1.2 v34.29,51.56 33.02,50.29 R5.1 | U$10.38 32.54,32.79 v33.02,33.27
  Bottom 0.254: v34.29,51.56 34.29,47.5 37.08,44.7 37.08,36.58 35.05,34.54 34.29,34.54 v33.02,33.27
TFT_DC  (via drill 0.5)
  Top 0.254: SJ4.2 v31.75,51.31 | v29.97,30.1 31.11,30.1 31.54,30.52 U$10.36
  Bottom 0.254: v29.97,30.1 29.84,30.23 29.84,34.42 28.96,35.31 28.96,45.09 31.75,47.88 v31.75,51.31
TFT_RST  (via drill 0.39, 0.5)
  Top 0.254: IC5.2 8.26,15.03 R7.1 8.26,14.22 v8.51,13.97 8.51,12.7 D1.A | U$10.10 18.54,30.23 v19.3,29.46 | U2.3 48.83,22.21 48.05,22.99 v47.24,22.99
  Bottom 0.254: v19.3,29.46 19.3,27.18 18.99,26.86 | 18.99,26.86 17.78,25.65 10.16,25.65 9.14,24.64 9.14,14.61 v8.51,13.97 | v47.24,22.99 44.2,26.04 19.81,26.04 18.99,26.86
TSC_PWR
  Top 0.254: U2.5 47.4,24.29 48.39,25.27 48.39,25.85 | 48.39,25.85 48.39,26.02 47.36,27.05 47.36,31.24 IC1.1 47.83,32.22 C2.1 | C5.1 48.39,25.85
TX
  Top 0.254: MS2.15 41.53,39.75 41.53,36.2 41.91,35.81 MS2.15'
  Top 0.406: TP19.P$1 MS2.15
USB
  Top 0.406: MS2.26' MS2.26 TP22.P$1
VBAT
  Top 0.254: MS2.28' 16,62.48 16,58.67 MS2.28 | TP21.P$1 16.51,53 R10.2
  Top 0.406: TP21.P$1 MS2.28
XL
  Top 0.203: IC1.4 45.16,30.86 44.27,29.97 44.27,27.94 43.3,26.98 37.85,26.98 36.6,28.23 36.6,31.67 U$10.46
XR
  Top 0.203: U$10.44 35.54,32.57 35.69,32.72 46.46,32.72 IC1.2
YD
  Top 0.203: U$10.45 36.04,28.22 37.69,26.57 38.08,26.57 38.1,26.54 43.56,26.54 44.79,27.77 44.79,29.84 45.81,30.86 IC1.3
YU
  Top 0.203: U$10.47 37.04,28.37 38.02,27.38 43.13,27.38 43.74,28 43.74,30.1 44.51,30.86 IC1.5

### Text on the board
Pinguin_tBackup: IRQ | SD | TFTDC | TFTCS | LITE | CD | A0 | A1 | TSC2007 I2C addr 0x48 | 2.4" TFT / FeatherWing / V2 | Reset | ON | OFF | MicroSD